# Altium schematic sheet CAN_IFC.SchDoc
size A3; Organization: Altium Limited; Address1: L3, 12a Rodborough Rd; Address2: Frenchs Forest; Address3: NSW; Address4: Australia 2086
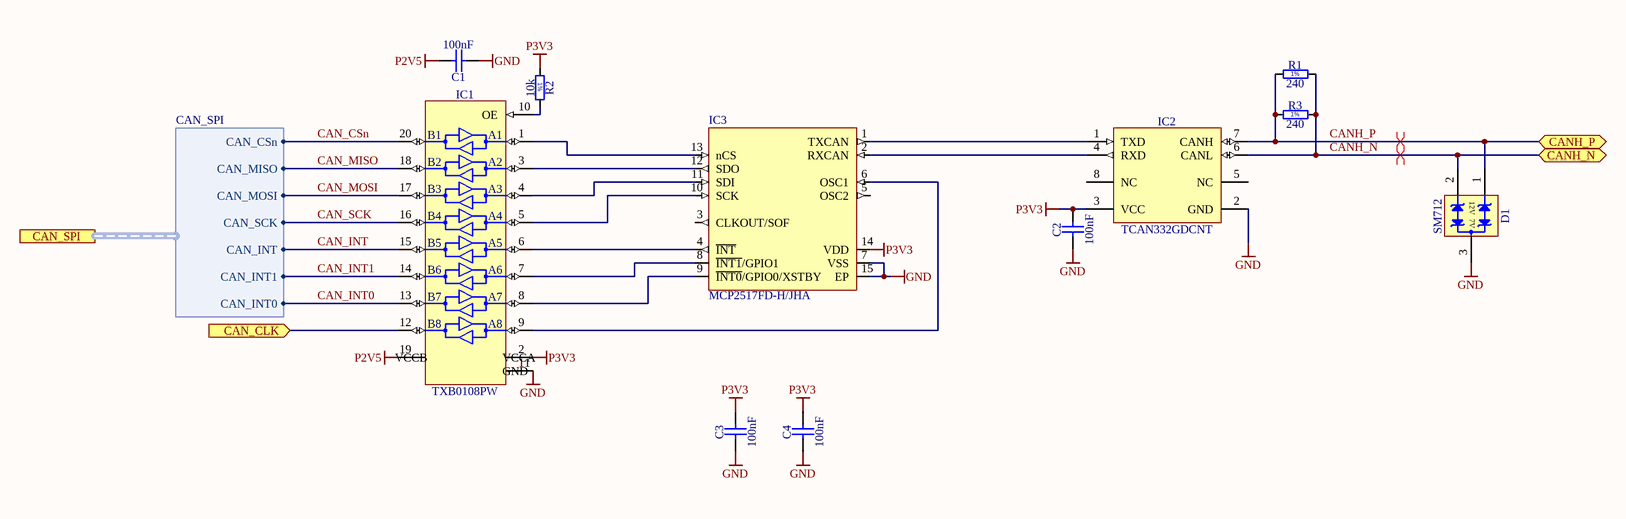
[diagram p0: CAN_IFC.SchDoc]

## Parts
C1  100nF  [CAPC1005X55N]
C2  100nF  [CAPC1005X55N]
C3  100nF  [CAPC1005X55N]
C4  100nF  [CAPC1005X55N]
D1  SM712  [SOT95P237X112-3N]
IC1  TXB0108PW  [SOP65P640X120-20N]
IC2  TCAN332GDCNT  [SOT65P280X145-8N]
IC3  MCP2517FD-H/JHA  [SON65P300X90_HS-15N]
R1  240  [RESC2012X60N]
R2  10k  [RESC1005X40N]
R3  240  [RESC2012X60N]

## Ports
CAN_CLK (in), CAN_SPI (harness CAN_SPI), CANH_N (bidir), CANH_P (bidir)

## Harnesses
CAN_SPI: CAN_INT1, CAN_INT, CAN_INT0, CAN_SCK, CAN_MOSI, CAN_MISO, CAN_CSn

## Nets
GND: C1.1 C2.1 C3.1 C4.1 D1.3(GND) IC1.11(GND) IC2.2(GND) IC3.7(VSS) IC3.15(EP)
P2V5: C1.2 IC1.19(Vccb)
P3V3: C2.2 C3.2 C4.2 IC1.2(Vcca) IC2.3(VCC) IC3.14(VDD) R2.1
CAN_CLK: IC1.12(B8) ; port CAN_CLK
CAN_CSn: IC1.20(B1) ; port CAN_SPI.CAN_CSn
CAN_INT: IC1.15(B5) ; port CAN_SPI.CAN_INT
CAN_INT0: IC1.13(B7) ; port CAN_SPI.CAN_INT0
CAN_INT1: IC1.14(B6) ; port CAN_SPI.CAN_INT1
CAN_MISO: IC1.18(B2) ; port CAN_SPI.CAN_MISO
CAN_MOSI: IC1.17(B3) ; port CAN_SPI.CAN_MOSI
CAN_SCK: IC1.16(B4) ; port CAN_SPI.CAN_SCK
CANH_N: D1.2(I/O2) IC2.6(CANL) R1.2 R3.2 ; port CANH_N
CANH_P: D1.1(I/O1) IC2.7(CANH) R1.1 R3.1 ; port CANH_P
NetIC1_1: IC1.1(A1) IC3.13(nCS)
NetIC1_3: IC1.3(A2) IC3.12(SDO)
NetIC1_4: IC1.4(A3) IC3.11(SDI)
NetIC1_5: IC1.5(A4) IC3.10(SCK)
NetIC1_6: IC1.6(A5) IC3.4(~{INT})
NetIC1_7: IC1.7(A6) IC3.8(~{INT1}/GPIO1)
NetIC1_8: IC1.8(A7) IC3.9(~{INT0}/GPIO0/XSTBY)
NetIC1_9: IC1.9(A8) IC3.6(OSC1)
NetIC1_10: IC1.10(OE) R2.2
NetIC2_1: IC2.1(TXD) IC3.1(TXCAN)
NetIC2_4: IC2.4(RXD) IC3.2(RXCAN)

Not connected (* = marked no-connect by the designer): IC2 5(NC) 8(NC); IC3 3(CLKOUT/SOF) 5(OSC2)

## Layout directives
differential pair: CANH_N, CANH_P

## Notes on the sheet
- Title
- Size:
- Date:
- A3
- Number:
- Time:
- Revision:
- Sheet
- of
- File:
- (in symbol R0402_10K_1%_0.0625W_100PPM) 1%
- (in symbol R0805_240R_1%_0.125W_100PPM) 1%
- (in symbol SM712) 12V; 7V
- (in symbol TXB0108PW) VCCB; VCCA

## Library data of the parts
C1-C4 = CC0402_100NF_16V_10%_X5R: Non-polarised capacitor; Part Description: SMD Multilayer Chip Ceramic Capacitor; Manufacturer: GENERIC; Manufacturer1 Part Number: GRM155R61C104KA88D; Voltage: 16V; TC: X5R; Tolerance: ±10%; Part Number: CC0402_100NF_16V_10%_X5R; Component Kind: Standard; Component Type: Standard; Pin Count: 2; Value: 100nF; Status: None; Manufacturer Part Number: CC0402_100NF_16V_10%_X5R; Case: 0402; Mounted: Yes; Socket: No; SMD: Yes; Sense: No; Manufacturer1 Example: MURATA; Manufacturer1 ComponentHeight: 0.55mm; HelpURL: \\cern.ch\dfs\Applications\Altium\Datasheets\CC0402_X5R_MURATA_GRM.pdf; Author: CERN DEM JLC; CreateDate: 10.12.2013; LatestRevisionDate: 10.12.2013
D1 = SM712: Asymmetrical TVS Diode for Extended Common-Mode RS-485; Manufacturer: SEMTECH; Voltage: 12V/-7V; Power: 400W; PressFit: No; Bonding: No; Part Number: SM712; Component Kind: Standard; Component Type: Standard; Device: SM712; PackageDescription: SOT, 0.95mm, pitch; 3 pin,1.30mm W X 2.92mm L X 1.12mm H body, IPC Medium Density; Status: Obsolete; Part Description: Asymmetrical TVS Diode for Extended Common-Mode RS-485; Manufacturer Part Number: SM712; Pin Count: 3; Case: SOT-23; Mounted: Yes; Socket: No; SMD: Yes; Sense: No; ComponentHeight: 1.12mm; HelpURL: \\cern.ch\dfs\Applications\Altium\Datasheets\SM712.pdf; Author: CERN DEM JLC; CreateDate: 23/04/2012; LatestRevisionDate: 23/04/2012
IC1 = TXB0108PW: 8-Bit Bidirectional Voltage-Level Translator with Automatic Direction Sensing and ±15kV ESD Protection; Manufacturer: TEXAS INSTRUMENTS; PressFit: No; Bonding: No; Part Number: TXB0108PW; Component Kind: Standard; Component Type: Standard; Device: TXB0108PW; PackageDescription: SOP, 20-Leads, Body 6.5x4.4mm, Pitch 0.65mm, IPC Medium Density; Part Description: 8-Bit Bidirectional Voltage-Level Translator with Automatic Direction Sensing and ±15kV ESD Protection; Manufacturer Part Number: TXB0108PW; Pin Count: 20; Case: TSSOP20; Mounted: Yes; Socket: No; SMD: Yes; Sense: No; ComponentHeight: 1.2mm; Author: CERN DEM MR; HelpURL: \\cern.ch\dfs\Applications\Altium\Datasheets\TXB0108PW.pdf; CreateDate: 01.04.2016; LatestRevisionDate: 01.04.2016
IC2 = TCAN332GDCNT: 3.3V CAN Transceivers with CAN FD (Flexible Data Rate); Manufacturer: TEXAS INSTRUMENTS; PressFit: No; Bonding: No; Part Number: TCAN332GDCNT; Component Kind: Standard; Component Type: Standard; Device: TCAN332GDCNT; PackageDescription: SOT, 0.65mm pitch; 8 pin, 1.625mm W X 2.90mm L X 1.45mm H body, IPC Medium Density; Part Description: 3.3V CAN Transceivers with CAN FD (Flexible Data Rate); Manufacturer Part Number: TCAN332GDCNT; Pin Count: 8; Case: SOT23-8; Mounted: Yes; Socket: No; SMD: Yes; Sense: No; ComponentHeight: 1.45mm; Author: CERN DEM JLC; HelpURL: \\cern.ch\dfs\Applications\Altium\Datasheets\TCAN332GDCNT.pdf; CreateDate: 22/08/2017; LatestRevisionDate: 22/08/2017
IC3 = IFC_MCP2517: External CAN FD Controller with SPI Interface; Manufacturer: Microchip; Case: VDFN14; Component Type: Standard; Device: MCP2517FD-H/JHA; Manufacturer Part Number: MCP2517FD-H/JHA; Mounted: Yes; PackageDescription: DFN, 14-Leads, Body 4.50x3.00mm, Pitch 0.65mm, Thermal Pad 4.20x1.60mm, IPC Medium Density; Part Description: External CAN FD Controller with SPI Interface; Part Number: MCP2517FD-H/JHA; Pin Count: 14; SMD: Yes
R1 R3 = R0805_240R_1%_0.125W_100PPM: Resistor - 1%; Part Description: General Purpose Thick Film Chip Resistor; Manufacturer: GENERIC; Manufacturer1 Part Number: NRC10F2400TRF; Power: 0.125W; TC: ±100ppm/°C; PressFit: No; Mounted: No; Part Number: R0805_240R_1%_0.125W_100PPM; Component Kind: Standard; Component Type: Standard; Pin Count: 2; Value: 240; Status: Preferred; Tolerance: ±1%; Manufacturer Part Number: R0805_240R_1%_0.125W_100PPM; Case: 0805; Sense: No; Socket: No; SMD: Yes; Manufacturer1 Example: NIC COMPONENT; Manufacturer1 ComponentHeight: 0.6mm; HelpURL: \\cern.ch\dfs\Applications\Altium\Datasheets\R0805_NIC_NRC.pdf; Author: CERN DEM JLC; CreateDate: 03.12.2007; LatestRevisionDate: 13.03.2008
R2 = R0402_10K_1%_0.0625W_100PPM: Resistor - 1%; Part Description: General Purpose Thick Film Chip Resistor; Manufacturer: GENERIC; Manufacturer1 Part Number: 232270671003L; TC: ±100ppm/°C; PressFit: No; Part Number: R0402_10K_1%_0.0625W_100PPM; Component Kind: Standard; Component Type: Standard; Pin Count: 2; Value: 10k; Status: Not Recommended; Power: 0.0625W; Tolerance: ±1%; Manufacturer Part Number: R0402_10K_1%_0.0625W_100PPM; Case: 0402; Mounted: Yes; Sense: No; Socket: No; SMD: Yes; Manufacturer1 Example: YAGEO PHYCOMP; Manufacturer1 ComponentHeight: 0.4mm; HelpURL: \\cern.ch\dfs\Applications\Altium\Datasheets\R0402_Phycomp_RC0402.pdf; Author: CERN DEM JLC; CreateDate: 03.12.2007; LatestRevisionDate: 17.10.2012